# Altium schematic sheet PWMOUT.SchDoc
size A
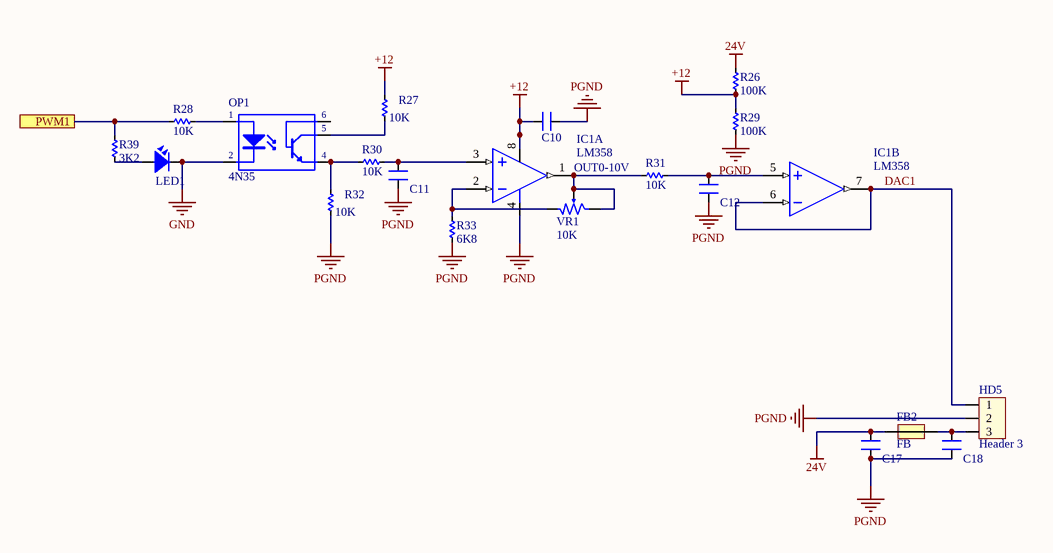
[diagram p0: PWMOUT.SchDoc]

## Parts
C10  100nF  [CN-SMD-0805]  (value not drawn)
C11  100nF  [CN-SMD-0805]  (value not drawn)
C12  100nF  [CN-SMD-0805]  (value not drawn)
C17  CN  [CN-SMD-0805]  (value not drawn)
C18  CN  [CN-SMD-0805]  (value not drawn)
FB2  FB  [Capacitor_805]
HD5  Header 3  [HED3T]
IC1  LM358  [DIP8/W0.3]  (parts A,B of 2)
LED1  LED  [LED-0805-Green]  (value not drawn)
OP1  4N35  [DIP6]
R26  100K  [RES-SMD-0805]
R27  10K  [RES-SMD-0805]
R28  10K  [RES-SMD-0805]
R29  100K  [RES-SMD-0805]
R30  10K  [RES-SMD-0805]
R31  10K  [RES-SMD-0805]
R32  10K  [RES-SMD-0805]
R33  6K8  [RES-SMD-0805]
R39  3K2  [RES-SMD-0805]
VR1  10K  [VR1]

## Ports
PWM1

## Nets
24V: C17.2 FB2.2 R26.2
+12: C10.2 IC1.8(+V) R26.1 R27.1 R29.1
GND: LED1.2 OP1.2(K)
PGND: C10.1 C11.2 C12.2 C17.1 C18.1 HD5.2 IC1.4(-V) R29.2 R32.2 R33.2
DAC1: HD5.1 IC1.6(IN-) IC1.7(OUT)
PWM1: R28.1 R39.1 ; port PWM1
NetC11_1: C11.1 IC1.3(IN+) R30.2
NetC12_1: C12.1 IC1.5(IN+) R31.2
NetC18_2: C18.2 FB2.1 HD5.3
NetIC1_1: IC1.1(OUT) R31.1 VR1.2 VR1.3
NetIC1_2: IC1.2(IN-) R33.1 VR1.1
NetLED1_1: LED1.1 R39.2
NetOP1_1: OP1.1(A) R28.2
NetOP1_4: OP1.4(E) R30.1 R32.1
NetOP1_5: OP1.5(C) R27.2

Not connected (* = marked no-connect by the designer): OP1 6(C)

## Notes on the sheet
- OUT0-10V

## Library data of the parts
C10-C12 C17 C18 = CN: Value: 33pF
HD5 = Hed3: Header 3 (Green); Value: Header 3
IC1 = LM358: Low-Power Dual Operational Amplifier; Value: LM358
LED1 = LED SMD: Value: LED 3 - 5 ly 2 Colour
OP1 = 4N35: Opto; Value: 4N35
R26-R33 R39 = R
VR1 = VR1: Var Resistor; Value: VR 10K